# EAGLE design source_eagle (EAGLE 6.4)
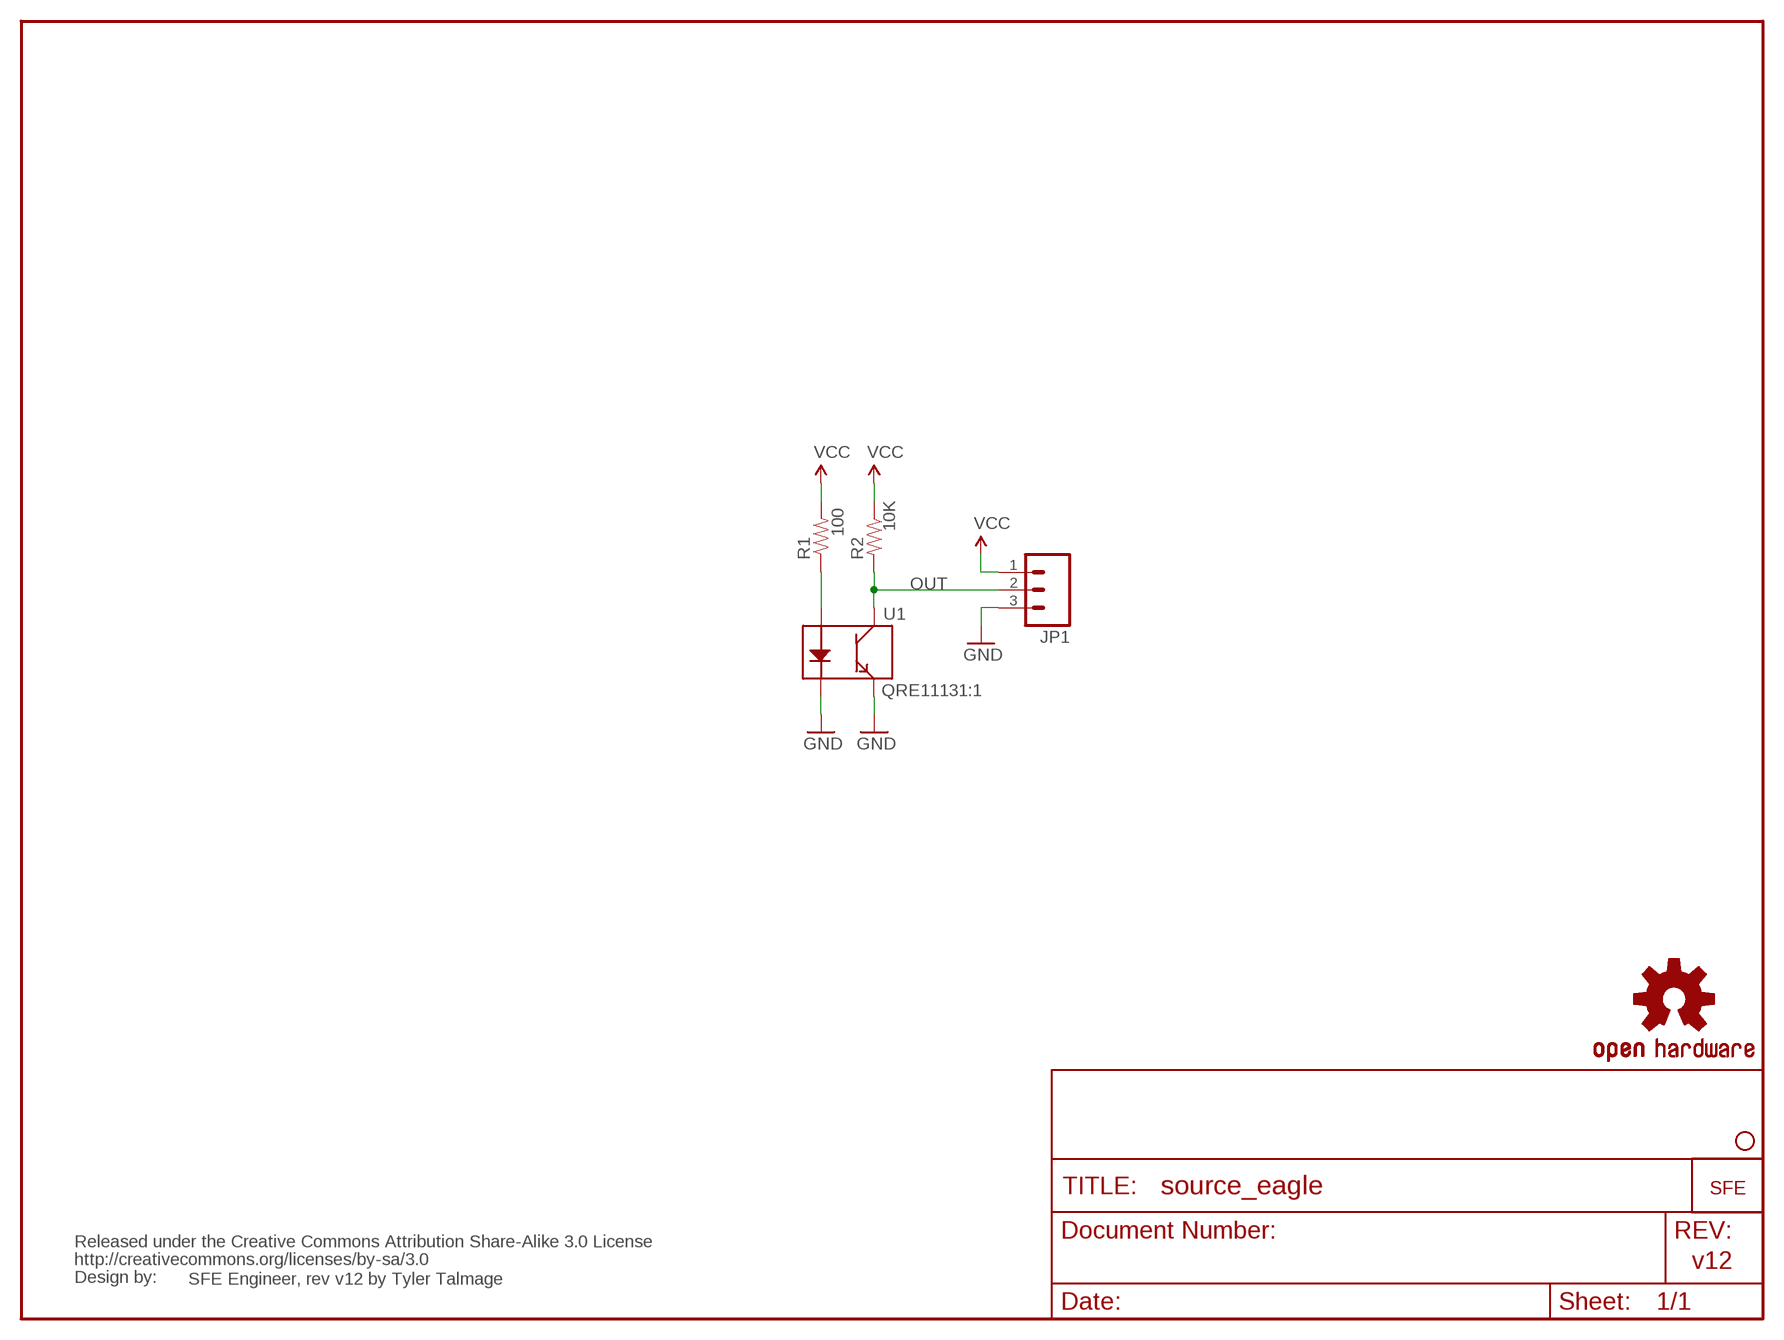
[diagram p0: schematic, sheet 1]

## Parts
CC_TEXT1  CREATIVE_COMMONS  [CREATIVE_COMMONS]
JP1  M03PTH  [1X03]
JP2  LOGO-SFESK  [SFE-LOGO-FLAME]
JP3  STAND-OFF  [STAND-OFF]
R1  100  RESISTOR0603-RES  [0603-RES]
R2  10K  RESISTOR0603-RES  [0603-RES]
U1  QRE11131:1  [QRE1113-1:1]
U$1  OSHW-LOGOS  [OSHW-LOGO-S]

## Nets
GND: JP1.3 U1.2(K) U1.4(E)
N$1: R1.1 U1.1(A)
OUT: JP1.2 R2.2 U1.3(C)
VCC: JP1.1 R1.2 R2.1

## Notes on the sheet
- v12
- SFE Engineer, rev v12 by Tyler Talmage

## Library data of the parts
CC_TEXT1 = SparkFun-Aesthetics:CREATIVE_COMMONS: Creative Commons License summary
JP1 = SparkFun:M03: Header 3 Standard 3-pin 0.1" header. Use with straight break away headers (SKU : PRT-00116), right angle break away headers (PRT-00553), swiss pins (PRT-00743), machine pins (PRT-00117), and female headers (PRT-00115). Molex polarized connector foot print use with SKU : PRT-08232 with associated crimp pins and housings.
JP2 = SparkFun:LOGO-SFE: Spark Fun Electronics PCB Logo This is the standard Spark Fun Electronics PCB logo.
JP3 = SparkFun:STAND-OFF: Stand Off This is the mechanical footprint for a #4 phillips button head screw. Use the keepout ring to avoid running the screw head into surrounding components. SKU : PRT-00447
R1 R2 = SparkFun:RESISTOR: Resistor Basic schematic elements and footprints for 0603, 1206, and PTH 1/10th watt (small) resistors.
U1 = Testing:QRE1113
U$1 = SparkFun:OSHW-LOGO: Open Source Hardware Logo This logo indicates the piece of hardware it is found on incorporates a OSHW license and/or adheres to the definition of open source hardware found here: http://freedomdefined.org/OSHW

## Board
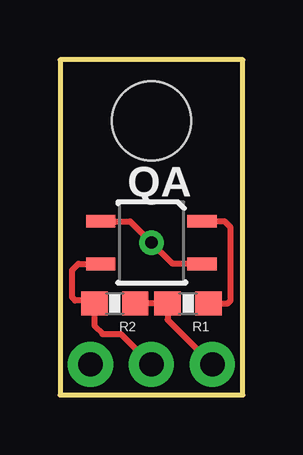
[diagram p1: board, top side]
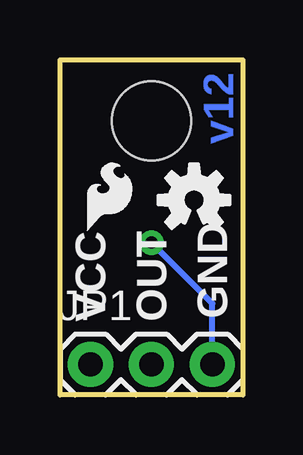
[diagram p2: board, bottom side, seen from below]

Size 7.62 x 13.97 mm. Coordinates in mm from the lower left corner, seen from the top.
Outline: 0,0 7.62,0 7.62,13.97 0,13.97 0,0
Copper layers (1*16): Top 0.035mm / dielectric 1.5mm / Bottom 0.035mm
Design rules "SparkFun *": minimum track width 8mil, minimum drill 20mil, track to track 8mil, track to pad 8mil, pad to pad 8mil, via to via 8mil, smd to smd 8mil, copper to edge 9mil, drill to drill 8mil, minimum pad ring 12mil, minimum via ring 10mil, stop-mask expansion 4mil, vias tented up to drill 20mil, thermal gap 10mil

### Footprints (pad centres in the part's own frame; a part is rotated, then mirrored left to right if it is on the bottom)
1X03 = drill 1.016 pad 1.88: 1 0,0; 2 2.54,0; 3 5.08,0
STAND-OFF = hole 3.302: 0,0
0603-RES = smd 1.1 x 1: 1 -0.85,0; 2 0.85,0
QRE1113-1:1 = smd 1.219 x 0.533: 1 -2.108,-0.889; 2 2.108,-0.889; 3 2.108,0.889; 4 -2.108,0.889

### Placement (x,y rotation side)
CC_TEXT1  21.59,-7.62 0 top  (outside the outline)
JP1  6.35,1.27 0 bottom
JP2  6.48,6.86 0 bottom
JP3  3.81,11.43 0 top
R1  5.33,3.81 180 top
R2  2.29,3.81 180 top
U1  3.81,6.35 180 top
U$1  2.03,8.13 0 bottom

### Tracks (layer width: path | path; a pad name or v marks a point on that pad's centre or on a via)
GND  (via drill 0.51)
  Top 0.254: U1.2 2.92,7.24 v3.81,6.35 4.7,5.46 U1.4
  Bottom 0.254: JP1.3 1.27,3.81 v3.81,6.35
N$1
  Top 0.254: R1.1 6.99,3.81 7.11,3.94 7.11,6.99 6.86,7.24 U1.1
OUT
  Top 0.254: R2.2 1.27,3.81 | R2.2 1.44,2.88 1.78,2.54 2.54,2.54 JP1.2 | R2.2 1.31,3.94 0.64,3.94 0.51,4.06 0.51,5.21 0.76,5.46 U1.3
VCC
  Top 0.254: R2.1 R1.2 4.48,3.14 JP1.1

### Text on the board
Bottom: v12
tPlace: QA
bPlace: GND | OUT | VCC
tValues: SFE Engineer, rev v12 by Tyler Talmage